# EAGLE schematic rel-rflag (EAGLE 9.6.2)
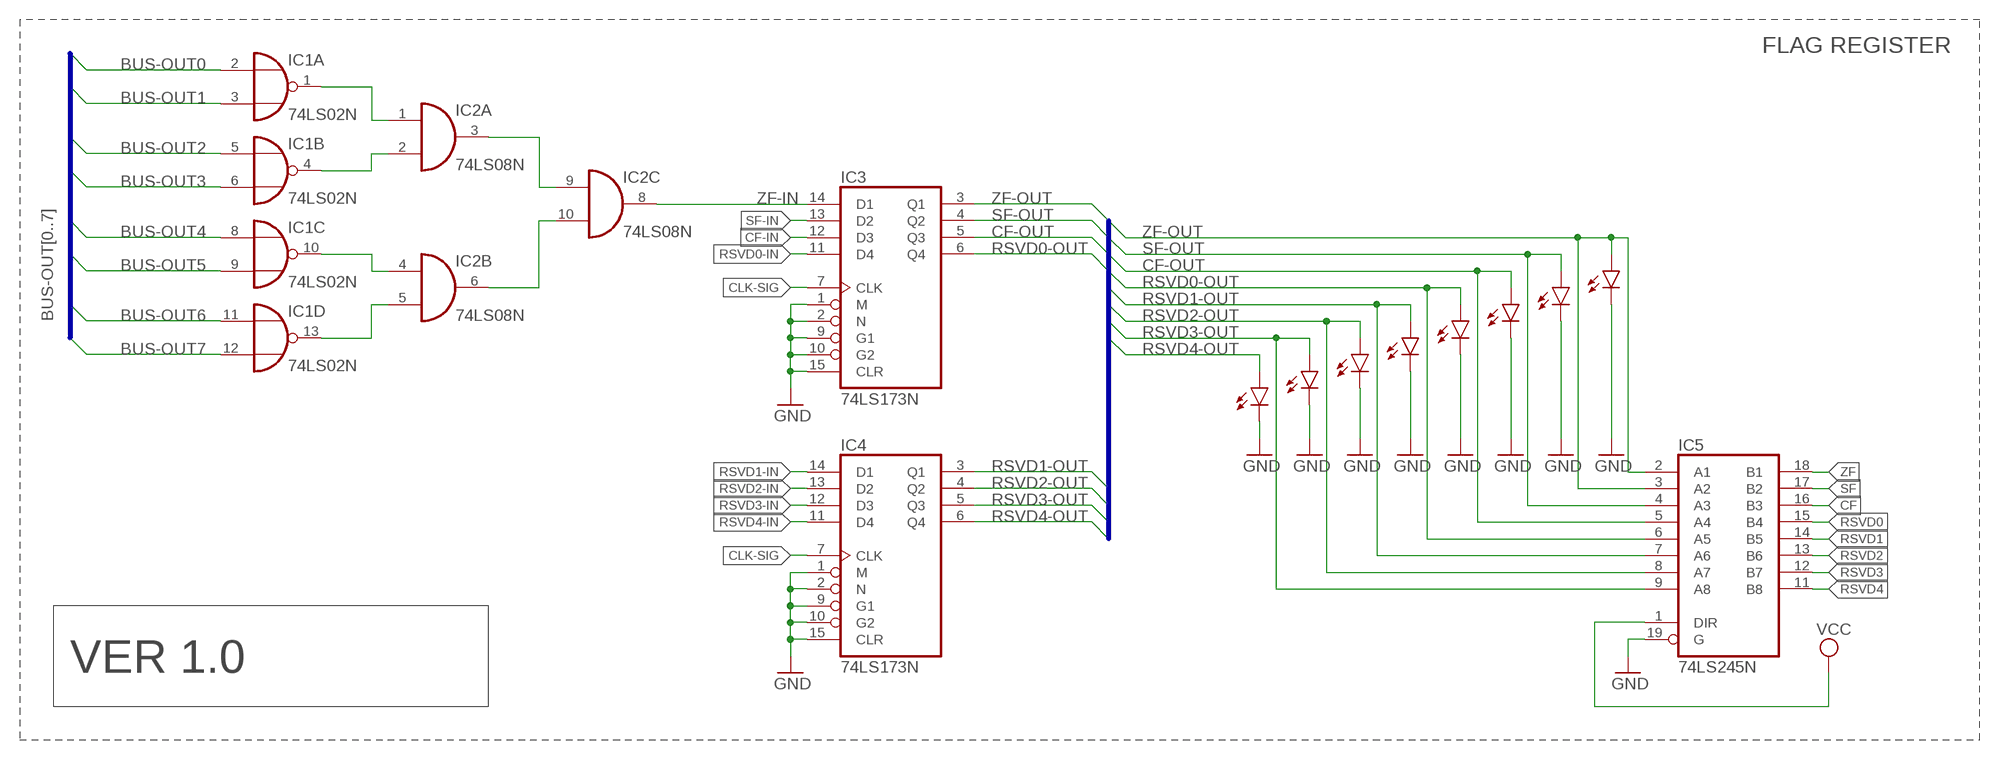
[diagram p0: schematic, sheet 1]

## Parts
IC1  74LS02N  [DIL14]
IC2  74LS08N  [DIL14]
IC3  74LS173N  [DIL16]
IC4  74LS173N  [DIL16]
IC5  74LS245N  [DIL20]
LED1  LED5MM  [LED5MM]
LED2  LED5MM  [LED5MM]
LED3  LED5MM  [LED5MM]
LED4  LED5MM  [LED5MM]
LED5  LED5MM  [LED5MM]
LED6  LED5MM  [LED5MM]
LED7  LED5MM  [LED5MM]
LED8  LED5MM  [LED5MM]

## Nets
BUS-OUT0: IC1.2(A:I0)
BUS-OUT1: IC1.3(A:I1)
BUS-OUT2: IC1.5(B:I0)
BUS-OUT3: IC1.6(B:I1)
BUS-OUT4: IC1.8(C:I0)
BUS-OUT5: IC1.9(C:I1)
BUS-OUT6: IC1.11(D:I0)
BUS-OUT7: IC1.12(D:I1)
CF: IC5.16(B3)
CF-IN: IC3.12(D3)
CF-OUT: IC3.5(Q3) IC5.5(A4) LED3.A
CLK-SIG: IC3.7(CLK) IC4.7(CLK)
GND: IC3.1(M) IC3.2(N) IC3.9(G1) IC3.10(G2) IC3.15(CLR) IC4.1(M) IC4.2(N) IC4.9(G1) IC4.10(G2) IC4.15(CLR) IC5.19(G) LED1.K(C) LED2.K(C) LED3.K(C) LED4.K(C) LED5.K(C) LED6.K(C) LED7.K(C) LED8.K(C)
N$9: IC1.1(A:O) IC2.1(A:I0)
N$10: IC1.4(B:O) IC2.2(A:I1)
N$11: IC1.10(C:O) IC2.4(B:I0)
N$12: IC1.13(D:O) IC2.5(B:I1)
N$13: IC2.3(A:O) IC2.9(C:I0)
N$14: IC2.6(B:O) IC2.10(C:I1)
RSVD0: IC5.15(B4)
RSVD0-IN: IC3.11(D4)
RSVD0-OUT: IC3.6(Q4) IC5.6(A5) LED4.A
RSVD1: IC5.14(B5)
RSVD1-IN: IC4.14(D1)
RSVD1-OUT: IC4.3(Q1) IC5.7(A6) LED5.A
RSVD2: IC5.13(B6)
RSVD2-IN: IC4.13(D2)
RSVD2-OUT: IC4.4(Q2) IC5.8(A7) LED6.A
RSVD3: IC5.12(B7)
RSVD3-IN: IC4.12(D3)
RSVD3-OUT: IC4.5(Q3) IC5.9(A8) LED7.A
RSVD4: IC5.11(B8)
RSVD4-IN: IC4.11(D4)
RSVD4-OUT: IC4.6(Q4) LED8.A
SF: IC5.17(B2)
SF-IN: IC3.13(D2)
SF-OUT: IC3.4(Q2) IC5.4(A3) LED2.A
VCC: IC5.1(DIR)
ZF: IC5.18(B1)
ZF-IN: IC2.8(C:O) IC3.14(D1)
ZF-OUT: IC3.3(Q1) IC5.2(A1) IC5.3(A2) LED1.A
Unconnected: IC2.11(D:O) IC2.12(D:I0) IC2.13(D:I1)

## Buses
BUS-OUT[0..7]
CF-OUT,RSVD0-OUT,RSVD1-OUT,RSVD2-OUT,RSVD3-OUT,RSVD4-OUT,SF-OUT,ZF-OUT

## Notes on the sheet
- FLAG REGISTER
- VER 1.0

## Power pins joined to a net without a drawn wire
GND: IC1.7(P:GND) IC2.7(P:GND) IC3.8(GND) IC4.8(GND) IC5.10(GND)
VCC: IC1.14(P:VCC) IC2.14(P:VCC) IC3.16(VCC) IC4.16(VCC) IC5.20(VCC)

## Library data of the parts
IC1 = 74xx-eu:74*02: Quad 2-input NOR gate
IC2 = 74xx-eu:74*08: Quad 2-input AND gate
IC3 IC4 = 74xx-eu:74*173: 4-bit D type REGISTER, 3-state
IC5 = 74xx-eu:74*245: Octal BUS TRANSCEIVER, 3-state
LED1-LED8 = led:LED: LED OSRAM: - CHIPLED LG R971, LG N971, LY N971, LG Q971, LY Q971, LO R971, LY R971 LH N974, LH R974 LS Q976, LO Q976, LY Q976 LO Q996 - Hyper CHIPLED LW Q18S LB Q993, LB Q99A, LB R99A - SideLED LS A670, LO A670, LY A670, LG A670, LP A670 LB A673, LV A673, LT A673, LW A673 LH A674 LY A675 LS A676, LA A676, LO A676, LY A676, LW A676 LS A679, LY A679, LG A679 - Hyper Micro SIDELED® LS Y876, LA Y876, LO Y876, LY Y876 LT Y87S - SmartLED LW L88C, LW L88S LB L89C, LB L89S, LG L890 LS L89K, LO L89K, LY L89K LS L896, LA L896, LO L896, LY L896 - TOPLED LS T670, LO T670, LY T670, LG T670, LP T670 LSG T670, LSP T670, LSY T670, LOP T670, LYG T670 LG T671, LOG T671, LSG T671 LB T673, LV T673, LT T673, LW T673 LH T674 LS T676, LA T676, LO T676, LY T676, LB T676, LH T676, LSB T676, LW T676 LB T67C, LV T67C, LT T67C, LS T67K, LO T67K, LY T67K, LW E67C LS E67B, LA E67B, LO E67B, LY E67B, LB E67C, LV E67C, LT E67C LW T67C LS T679, LY T679, LG T679 LS T770, LO T770, LY T770, LG T770, LP T770 LB T773, LV T773, LT T773, LW T773 LH T774 LS E675, LA E675, LY E675, LS T675 LS T776, LA T776, LO T776, LY T776, LB T776 LHGB T686 LT T68C, LB T68C - Hyper Mini TOPLED® LB M676 - Mini TOPLED Santana® LG M470 LS M47K, LO M47K, LY M47K Source: http://www.osram.convergy.de LUXEON: - LUMILED® LXK2-PW12-R00, LXK2-PW12-S00, LXK2-PW14-U00, LXK2-PW14-V00 LXK2-PM12-R00, LXK2-PM12-S00, LXK2-PM14-U00 LXK2-PE12-Q00, LXK2-PE12-R00, LXK2-PE12-S00, LXK2-PE14-T00, LXK2-PE14-U00 LXK2-PB12-K00, LXK2-PB12-L00, LXK2-PB12-M00, LXK2-PB14-N00, LXK2-PB14-P00, LXK2-PB14-Q00 LXK2-PR12-L00, LXK2-PR12-M00, LXK2-PR14-Q00, LXK2-PR14-R00 LXK2-PD12-Q00, LXK2-PD12-R00, LXK2-PD12-S00 LXK2-PH12-R00, LXK2-PH12-S00 LXK2-PL12-P00, LXK2-PL12-Q00, LXK2-PL12-R00 Source: www.luxeon.com KINGBRIGHT: KA-3528ASYC Source: www.kingbright.com